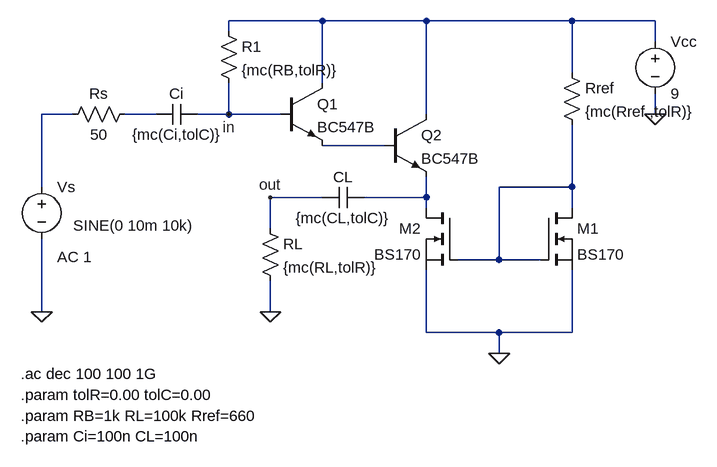
[diagram p0: schematic AL_A.asc]
AL_A.asc, the LTspice schematic file:
Version 4
SHEET 1 2424 680
WIRE 176 16 32 16
WIRE 336 16 176 16
WIRE 560 16 336 16
WIRE 688 16 560 16
WIRE 32 32 32 16
WIRE 688 48 688 16
WIRE 560 96 560 16
WIRE 176 112 176 16
WIRE -208 160 -256 160
WIRE -80 160 -128 160
WIRE 32 160 32 112
WIRE 32 160 -16 160
WIRE 112 160 32 160
WIRE 336 160 336 16
WIRE 688 160 688 128
WIRE 272 208 176 208
WIRE -256 272 -256 160
WIRE 560 272 560 176
WIRE 560 272 448 272
WIRE 176 288 96 288
WIRE 336 288 336 256
WIRE 336 288 240 288
WIRE 336 304 336 288
WIRE 560 304 560 272
WIRE 96 336 96 288
WIRE 448 384 448 272
WIRE 448 384 384 384
WIRE 512 384 448 384
WIRE -256 464 -256 352
WIRE 96 464 96 416
WIRE 336 496 336 400
WIRE 448 496 336 496
WIRE 560 496 560 400
WIRE 560 496 448 496
WIRE 448 528 448 496
FLAG 688 160 0
FLAG -256 464 0
FLAG 32 160 in
FLAG 448 528 0
FLAG 96 464 0
FLAG 96 288 out
SYMBOL npn 112 112 R0
SYMATTR InstName Q1
SYMATTR Value BC547B
SYMBOL npn 272 160 R0
SYMATTR InstName Q2
SYMATTR Value BC547B
SYMBOL res 16 16 R0
SYMATTR InstName R1
SYMATTR Value {mc(RB,tolR)}
SYMBOL voltage 688 32 R0
WINDOW 123 0 0 Left 0
WINDOW 39 0 0 Left 0
SYMATTR InstName Vcc
SYMATTR Value 9
SYMBOL cap -16 144 R90
WINDOW 0 0 32 VBottom 2
WINDOW 3 32 32 VTop 2
SYMATTR InstName Ci
SYMATTR Value {mc(Ci,tolC)}
SYMBOL voltage -256 256 R0
WINDOW 123 24 124 Left 2
WINDOW 39 0 0 Left 0
WINDOW 3 49 75 Left 2
SYMATTR Value2 AC 1
SYMATTR Value SINE(0 10m 10k)
SYMATTR InstName Vs
SYMBOL res -112 144 R90
WINDOW 0 0 56 VBottom 2
WINDOW 3 32 56 VTop 2
SYMATTR InstName Rs
SYMATTR Value 50
SYMBOL nmos 512 304 R0
SYMATTR InstName M1
SYMATTR Value BS170
SYMBOL nmos 384 304 M0
SYMATTR InstName M2
SYMATTR Value BS170
SYMBOL res 544 80 R0
SYMATTR InstName Rref
SYMATTR Value {mc(Rref ,tolR)}
SYMBOL cap 240 272 R90
WINDOW 0 0 32 VBottom 2
WINDOW 3 32 32 VTop 2
SYMATTR InstName CL
SYMATTR Value {mc(CL,tolC)}
SYMBOL res 80 320 R0
SYMATTR InstName RL
SYMATTR Value {mc(RL,tolR)}
TEXT -288 560 Left 2 !.ac dec 100 100 1G
TEXT -288 592 Left 2 !.param tolR=0.00 tolC=0.00
TEXT -288 624 Left 2 !.param RB=1k RL=100k Rref=660
TEXT -288 656 Left 2 !.param Ci=100n CL=100n

The netlist it stands for:
* AL_A.asc
Q1 N001 in N004 0 BC547B
Q2 N001 N004 N006 0 BC547B
R1 N001 in {mc(RB,tolR)}
Vcc N001 0 9
Ci in N003 {mc(Ci,tolC)}
Vs N002 0 SINE(0 10m 10k) AC 1
Rs N003 N002 50
M1 N005 N005 0 0 BS170
M2 N006 N005 0 0 BS170
Rref N001 N005 {mc(Rref ,tolR)}
CL N006 out {mc(CL,tolC)}
RL out 0 {mc(RL,tolR)}
.model NPN NPN
.model PNP PNP
.lib standard.bjt
.model NMOS NMOS
.model PMOS PMOS
.lib standard.mos
.ac dec 100 100 1G
.param tolR=0.00 tolC=0.00
.param RB=1k RL=100k Rref=660
.param Ci=100n CL=100n
.backanno
.end